# EasyEDA Pro project 3轴6.2--esp32S3.eprj, board PCB
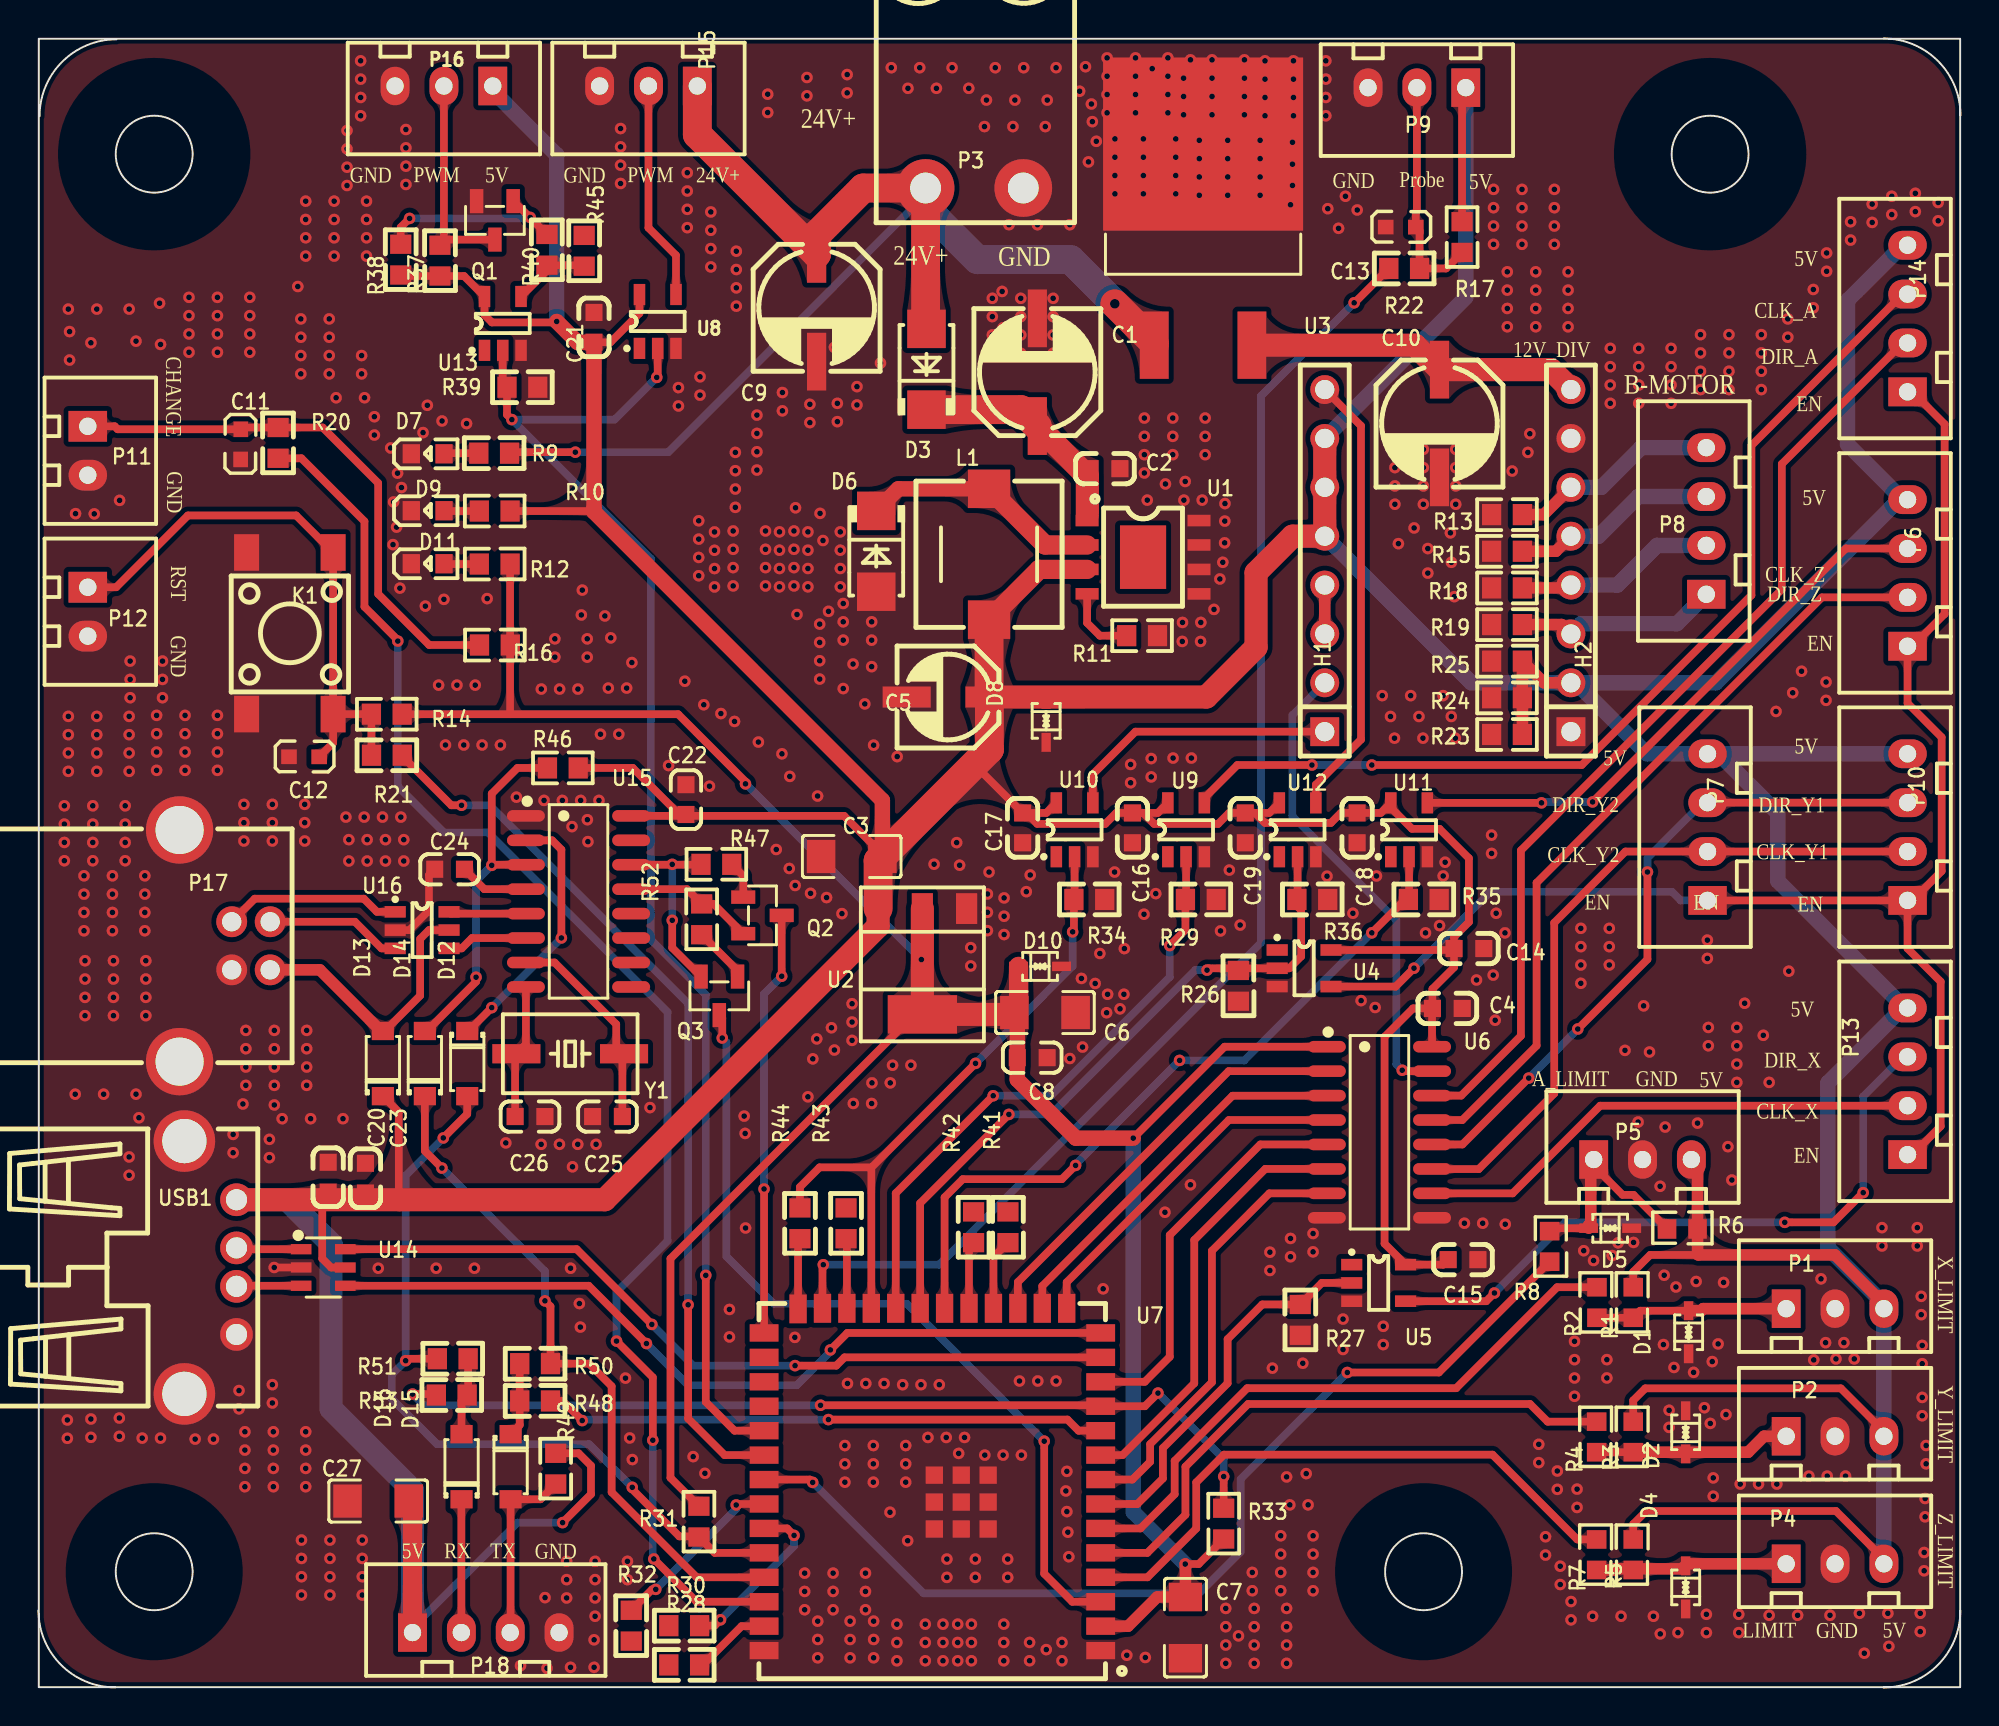
[diagram p1: board, top side]
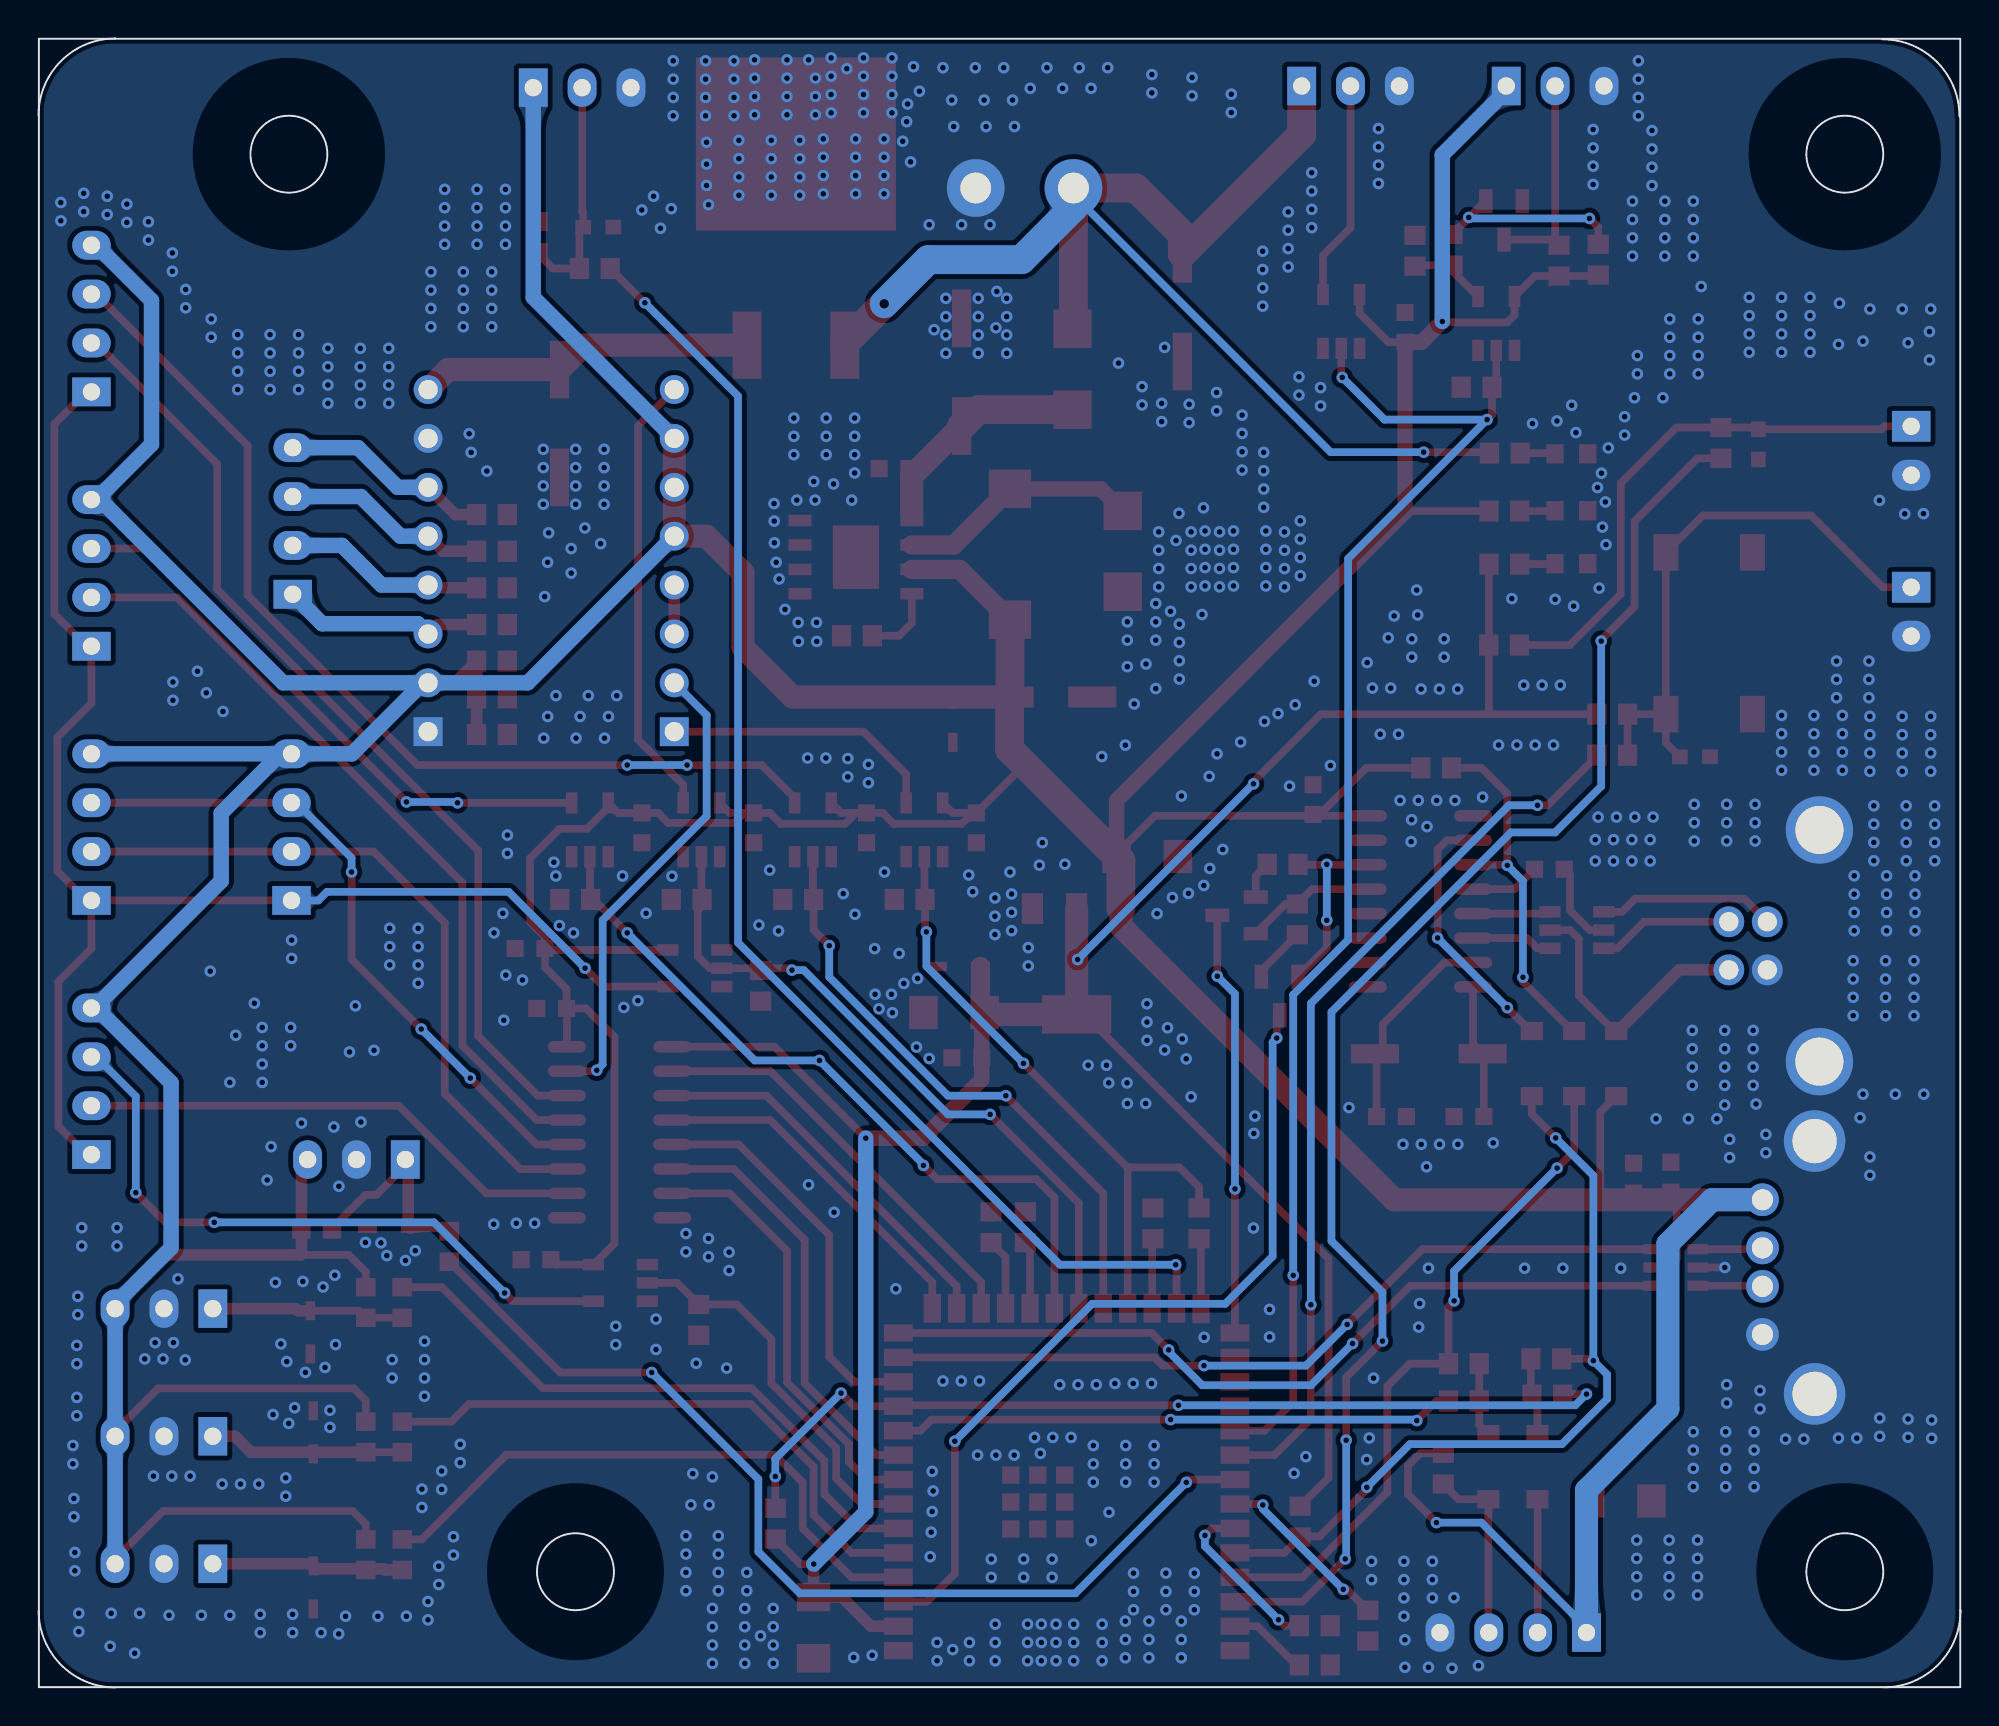
[diagram p2: board, bottom side, seen from below]

Outline 99.94 x 85.7 mm; copper layers: Top Layer, Bottom Layer. Coordinates in mm from the lower left corner of the outline.
Outline path: rectangle 0.02,85.69 99.92,0.02 ; circle c6.02,79.69 r2 ; circle c6.02,6.02 r2 ; circle c72.02,6.02 r2 ; circle c86.92,79.69 r2 ; 0.06,81.66 arc(1.23,84.49) 4.06,85.66 ; 4,0.01 arc(1.17,1.18) 0,4.01 ; 95.94,85.7 arc(98.77,84.53) 99.94,81.7 ; 99.93,4 arc(98.76,1.17) 95.93,0
Stack: Top Layer 0.035mm / Dielectric1 1.51mm FR4 er 4.5 / Bottom Layer 0.035mm

## Design rules (mm)
template: 用户自定义配置
spacing Default (default): track to track 0.152, other pairs 0 to 0.152
track width Default (default): min 0.254, default 0.254, max 25.4
differential pair differentialPair (default): width min 0.127, default 0.254, max 2.54; gap min 0.152, default 0.152
via Default (default): diameter min 0.25, default 0.61, max 100.025; hole min 0.2, default 0.305, max 59.995

## Placement (name value [footprint] x y rotation side)
C1  100uF/35V  [电解电容贴片6X6]  51.94 68.36 90 top
C2  104  [0603C]  55.45 63.34 180 top
C3  10uF  [C1206]  42.29 43.19 180 top
C4  104  [0603C]  73.25 35.29 180 top
C5  100uF/10V  [CAP-SMD_BD5.0-L5.3-W5.3-RD]  47.3 51.48 0 top
C6  4.7uF  [C1206]  52.33 35.08 180 top
C7  4.7uF  [C1206]  59.64 3.11 90 top
C8  104  [0603C]  51.67 32.73 180 top
C9  100uF/35V  [电解电容贴片6X6]  40.46 71.71 270 top
C10  100uF/35V(47uF/50V)  [电解电容贴片6X6]  72.85 65.69 270 top
C11  103  [11]  10.22 63.87 270 top
C12  103  [11]  13.07 48.67 180 top
C13  103  [11]  70.09 76.2 180 top
C14  104  [0603C]  74.38 38.4 180 top
C15  104  [0603C]  74.07 22.24 180 top
C16  104  [0603C]  56.88 44.68 90 top
C17  104  [0603C]  51.17 44.68 90 top
C18  104  [0603C]  68.56 44.68 90 top
C19  104  [0603C]  62.75 44.68 90 top
C20  104  [0603C]  17 26.47 90 top
C21  104  [0603C]  28.88 70.69 270 top
C22  104  [0603C]  33.67 46.15 90 top
C23  104  [0603C]  15.06 26.52 90 top
C24  104  [0603C]  21.38 42.53 180 top
C25  18pF  [0603C]  29.59 29.67 180 top
C26  18pF  [0603C]  25.56 29.67 0 top
C27  10uF  [C1206]  17.66 9.69 180 top
D1  PESD5V0L1BA  [SOD-323_L1.8-W1.3-LS2.5-BI]  85.8 18.46 90 top
D2  PESD5V0L1BA  [SOD-323_L1.8-W1.3-LS2.5-BI]  85.65 13.26 270 top
D3  SS56  [SMA]  46.17 68.51 90 top
D4  PESD5V0L1BA  [SOD-323_L1.8-W1.3-LS2.5-BI]  85.65 5.2 90 top
D5  PESD5V0L1BA  [SOD-323_L1.8-W1.3-LS2.5-BI]  81.72 23.87 180 top
D6  SS34  [SMA]  43.56 59.05 270 top
D7  绿光  [0603LED]  20.2 64.1 180 top
D8  PESD5V0L1BA-N  [SOD-323_L1.8-W1.3-LS2.5-BI]  52.39 50.24 90 top
D9  绿光  [0603LED]  20.2 61.14 180 top
D10  PESD3V3L1BA-N  [SOD-323_L1.8-W1.3-LS2.5-BI]  52.08 37.48 180 top
D11  绿光  [0603LED]  20.2 58.39 180 top
D12  1N4148  [SOD-123_L2.8-W1.8-LS3.7-RD]  22.29 32.43 270 top
D13  1N4148  [SOD-123_L2.8-W1.8-LS3.7-RD]  17.91 32.43 90 top
D14  1N4148  [SOD-123_L2.8-W1.8-LS3.7-RD]  20.09 32.43 90 top
D15  1N4148  [SOD-123_L2.8-W1.8-LS3.7-RD]  24.55 11.48 270 top
D16  1N4148  [SOD-123_L2.8-W1.8-LS3.7-RD]  22 11.48 90 top
H1  PZ254V-11-08P  [HDR-TH_8P-P2.54-V-M]  66.88 58.57 90 top
H2  PZ254V-11-08P  [HDR-TH_8P-P2.54-V-M]  79.68 58.57 90 top
K1  SW_6X6_H=12.0MM  [KEY-SMD_4P-L6.0-W6.0-P4.50-LS9.0]  13.07 54.79 90 top
L1  68uH  [IND-SMD_L7.0-W7.0_SMDRI74-330MT]  49.43 58.9 90 top
P1  3P  [HDR1X3_CON]  93.41 19.69 0 top
P2  3P  [HDR1X3_CON]  93.41 13.06 0 top
P3  WJ2EDGR-5.08-2P  [CONN-TH_WJ2EDGR-5.08-2P]  48.67 77.93 180 top
P4  3P  [HDR1X3_CON]  93.41 6.43 0 top
P5  3P  [HDR1X3_CON]  83.4 27.44 0 top
P6  4P  [HDR1X4_CON]  97.18 54.11 90 top
P7  4P  [HDR1X4_CON]  86.78 40.91 90 top
P8  4P  [HDR1X4_CON]  86.72 56.82 90 top
P9  3P  [HDR1X3_CON]  71.67 83.15 180 top
P10  4P  [HDR1X4_CON]  97.18 40.91 90 top
P11  2P  [HDR1X2_CON]  2.57 64.28 270 top
P12  2P  [HDR1X2_CON]  2.57 55.91 270 top
P13  4P  [HDR1X4_CON]  97.18 27.7 90 top
P14  4P  [HDR1X4_CON]  97.18 67.34 90 top
P15  3P  [HDR1X3_CON]  31.72 83.23 180 top
P16  3P  [HDR1X3_CON]  21.08 83.23 180 top
P17  USB-B10-BRW  [USB-B-TH_USB-B10-BRW]  9.69 38.55 270 top
P18  4P  [HDR1X4_CON]  19.45 2.86 0 top
Q1  SS8050  [SOT-23-3_L2.9-W1.3-P1.90-LS2.4-BR]  23.73 76.25 90 top
Q2  SS8050  [SOT-23-3_L2.9-W1.3-P1.90-LS2.4-BR]  37.64 40.13 180 top
Q3  SS8050  [SOT-23-3_L2.9-W1.3-P1.90-LS2.4-BR]  35.4 35.95 90 top
R1  20K  [10]  83.04 19.12 90 top
R2  100  [10]  81.15 19.12 90 top
R3  20K  [10]  83.04 12.13 90 top
R4  100  [10]  81.14 12.13 90 top
R5  20K  [10]  83.04 6.01 90 top
R6  20K  [10]  84.58 23.72 0 top
R7  100  [10]  81.14 6.01 90 top
R8  100  [10]  78.46 23.82 270 top
R9  47K  [0603R]  23.69 64.15 0 top
R10  10K  [0603R]  23.72 61.14 0 top
R11  10K  [0603R]  57.38 54.66 0 top
R12  10K  [0603R]  23.72 58.39 0 top
R13  10K  [0603R]  76.36 60.96 180 top
R14  10K  [0603R]  18.11 50.58 180 top
R15  10K  [0603R]  76.36 59.05 180 top
R16  10K  [0603R]  23.73 54.18 180 top
R17  10K  [0603R]  74.02 75.38 270 top
R18  10K  [0603R]  76.36 57.15 180 top
R19  10K  [0603R]  76.36 55.24 180 top
R20  100  [0603R]  12.46 64.68 90 top
R21  100  [0603R]  18.12 48.45 180 top
R22  100  [0603R]  71.01 73.75 0 top
R23  10K  [0603R]  76.36 49.53 180 top
R24  10K  [0603R]  76.36 51.44 180 top
R25  10K  [0603R]  76.36 53.34 180 top
R26  10K  [0603R]  62.39 36.47 270 top
R27  10K  [0603R]  65.61 19.11 270 top
R28  0Ω  [0603R]  33.58 1.17 0 top
R29  10K  [0603R]  60.44 40.95 0 top
R30  0Ω  [0603R]  33.58 3.21 0 top
R31  10K  [0603R]  34.34 8.62 270 top
R32  0Ω  [0603R]  30.82 3.21 90 top
R33  10K  [0603R]  61.63 8.52 270 top
R34  10K  [0603R]  54.64 40.95 0 top
R35  10K  [0603R]  72.03 40.95 0 top
R36  10K  [0603R]  66.23 40.95 0 top
R37  10K  [0603R]  20.88 74.16 270 top
R38  10K  [0603R]  18.84 74.21 270 top
R39  10K  [0603R]  25.16 67.58 0 top
R40  1K  [0603R]  26.44 74.72 90 top
R41  0Ω  [0603R]  50.41 23.92 270 top
R42  0Ω  [0603R]  48.62 23.92 270 top
R43  0Ω  [0603R]  41.99 24.12 270 top
R44  0Ω  [0603R]  39.59 24.12 270 top
R45  0Ω  [0603R]  28.37 74.67 270 top
R46  10K  [0603R]  27.27 47.79 0 top
R47  10K  [0603R]  35.25 42.78 0 top
R48  0Ω  [0603R]  25.82 14.89 0 top
R49  10K  [0603R]  26.89 11.37 90 top
R50  0Ω  [0603R]  25.82 16.83 180 top
R51  0Ω  [0603R]  21.54 17.09 0 top
R52  10K  [0603R]  34.48 39.92 270 top
R53  0Ω  [0603R]  21.49 15.2 0 top
U1  XL1509-5.0E1//SXL1509-5.0E1  [ESOP-8_L4.9-W3.9-P1.27-LS6.0-BL-EP]  57.43 58.74 270 top
U2  1117-3.3  [SOT-223]  45.96 37.78 180 top
U3  CJ7812  [TO-263-2_L10.1-W9.1-P5.08-LS15.2-TL]  60.55 74.99 90 top
U4  74LVC1G04  [SOT-23-5]  65.81 37.38 0 top
U5  74LVC1G17  [SOT-23-5]  69.68 21.03 0 top
U6  CA-IS3760  [SOIC-16_L9.9-W3.9-P1.27-LS6.0-BL]  69.72 28.86 270 top
U7  -  [ESP32-S3-WROOM-1U]  46.48 10.81 180 top
U8  74LVC1G17  [SOT-23-5]  32.2 70.99 90 top
U9  74LVC1G17  [SOT-23-5]  59.67 44.58 90 top
U10  74LVC1G17  [SOT-23-5]  53.87 44.58 90 top
U11  74LVC1G17  [SOT-23-5]  71.27 44.58 90 top
U12  74LVC1G17  [SOT-23-5]  65.47 44.58 90 top
U13  74LVC1G04  [SOT-23-5]  24.14 70.89 90 top
U14  MSUSBLC6-2SC6  [SOT-23-6_L2.9-W1.6-P0.95-LS2.8-BL]  14.81 21.83 270 top
U15  CH340G  [SOIC-16_L9.9-W3.9-P1.27-LS6.0-BL]  28.08 40.85 270 top
U16  USBLC2-2SC6  [SOT-23-6]  19.95 39.36 0 top
USB1  AF 90° WJDG  [USB-A-TH_AF-WJDG]  8.94 21.83 270 top
Y1  12M  [晶振贴片49SSMD]  27.65 32.94 0 top

## Footprints (pads in the part's own frame, mm; a bottom-side part is the same pattern mirrored in y, then rotated)
10
  rect 0.965x1.016 smd: 1(0.101,0.117) 2(1.688,0.117)
11
  rect 0.813x0.762 smd: 1(0.043,0.296) 2(-1.524,0.301)
0603C
  rect 0.889x0.889 smd: 1(-0.774,0) 2(0.774,0)
0603LED
  rect 0.9x1 smd: 1(-0.884,-0.017) 2(0.816,-0.017)
0603R
  rect 1x1.1 smd: 1(-0.8,0) 2(0.8,0)
C1206
  rect 1.485x1.728 smd: 1(-1.593,0) 2(1.593,0)
CAP-SMD_BD5.0-L5.3-W5.3-RD
  rect 2.5x1.1 smd: 1(2.15,0) 2(-2.15,0)
CONN-TH_WJ2EDGR-5.08-2P
  round 3 hole 1.6: 1(-2.54,0) 2(2.54,0)
ESOP-8_L4.9-W3.9-P1.27-LS6.0-BL-EP
  rect 0.6x1.2 smd: 1(-1.905,-2.909) 2(-0.635,-2.909) 3(0.635,-2.909) 4(1.905,-2.909) 5(1.905,2.909) 6(0.635,2.909) 7(-0.635,2.909) 8(-1.905,2.909)
  rect 3.3x2.4 smd: 9(0,0)
ESP32-S3-WROOM-1U
  rect 1.5x0.9 smd: 1(-8.75,8.895) 2(-8.75,7.625) 3(-8.75,6.355) 4(-8.75,5.085) 5(-8.75,3.815) 6(-8.75,2.545) 7(-8.75,1.275) 8(-8.75,0.005) 9(-8.75,-1.265) 10(-8.75,-2.535) 11(-8.75,-3.805) 12(-8.75,-5.075) 13(-8.75,-6.345) 14(-8.75,-7.615) 27(8.75,-7.615) 28(8.75,-6.345) 29(8.75,-5.075) 30(8.75,-3.805) 31(8.75,-2.535) 32(8.75,-1.265) 33(8.75,0.005) 34(8.75,1.275) 35(8.75,2.545) 36(8.75,3.815) 37(8.75,5.085) 38(8.75,6.355) 39(8.75,7.625) 40(8.75,8.895)
  rect 0.9x1.5 smd: 15(-6.985,-8.895) 16(-5.715,-8.895) 17(-4.445,-8.895) 18(-3.175,-8.895) 19(-1.905,-8.895) 20(-0.635,-8.895) 21(0.635,-8.895) 22(1.905,-8.895) 23(3.175,-8.895) 24(4.445,-8.895) 25(5.715,-8.895) 26(6.985,-8.865)
  rect 0.9x0.9 smd: 41(-2.9,2.575) 41(-2.9,1.175) 41(-2.9,-0.225) 41(-1.5,2.575) 41(-1.5,1.175) 41(-1.5,-0.225) 41(-0.1,2.575) 41(-0.1,1.175) 41(-0.1,-0.225)
HDR1X2_CON
  rect 1.6x2 hole 0.9: 1(-1.27,0)
  oval 1.6x2 hole 0.9: 2(1.27,0)
HDR1X3_CON
  rect 1.5x2 hole 0.9: 1(-2.54,0)
  oval 1.5x2 hole 0.9: 2(0,0) 3(2.54,0)
HDR1X4_CON
  rect 1.5x2 hole 0.9: 1(0,0)
  oval 1.5x2 hole 0.9: 2(2.54,0) 3(5.08,0) 4(7.62,0)
HDR-TH_8P-P2.54-V-M
  rect 1.5x1.5 hole 1: 1(-8.89,0)
  round 1.5 hole 1: 2(-6.35,0) 3(-3.81,0) 4(-1.27,0) 5(1.27,0) 6(3.81,0) 7(6.35,0) 8(8.89,0)
IND-SMD_L7.0-W7.0_SMDRI74-330MT
  rect 2x2.2 smd: 1(-3.4,0) 2(3.4,0)
KEY-SMD_4P-L6.0-W6.0-P4.50-LS9.0
  rect 1.9x1.3 smd: 1(-4.2,2.25) 2(4.2,2.25) 3(-4.2,-2.25) 4(4.2,-2.25)
SMA
  rect 2x2 smd: 1(2.1,0) 2(-2.1,0)
SOD-123_L2.8-W1.8-LS3.7-RD
  rect 0.95x1.15 smd: 1(-1.692,0) 2(1.692,0)
SOD-323_L1.8-W1.3-LS2.5-BI
  rect 0.986x0.49 smd: 1(-1.117,0) 2(1.117,0)
SOIC-16_L9.9-W3.9-P1.27-LS6.0-BL
  oval 0.602x1.971 smd: 1(-4.445,-2.736) 2(-3.175,-2.736) 3(-1.905,-2.736) 4(-0.635,-2.736) 5(0.635,-2.736) 6(1.905,-2.736) 7(3.175,-2.736) 8(4.445,-2.736) 9(4.445,2.736) 10(3.175,2.736) 11(1.905,2.736) 12(0.635,2.736) 13(-0.635,2.736) 14(-1.905,2.736) 15(-3.175,2.736) 16(-4.445,2.736)
SOT-23-3_L2.9-W1.3-P1.90-LS2.4-BR
  rect 1.25x0.7 smd: 1(1,-0.95) 2(1,0.95) 3(-1,0)
SOT-23-5
  rect 1.1x0.6 smd: 1(-1.4,0.95) 2(-1.4,0) 3(-1.4,-0.95) 4(1.4,-0.95) 5(1.4,0.95)
SOT-23-6
  rect 1.1x0.6 smd: 1(-1.4,0.95) 2(-1.4,0) 3(-1.4,-0.95) 4(1.4,-0.95) 5(1.4,0) 6(1.4,0.95)
SOT-23-6_L2.9-W1.6-P0.95-LS2.8-BL
  rect 0.532x1.072 smd: 1(-0.95,-1.149) 2(0,-1.149) 3(0.95,-1.149) 4(0.95,1.149) 5(0,1.149) 6(-0.95,1.149)
SOT-223
  rect 1.1x1.6 smd: 1(-2.3,-2.7) 2(0,-2.7) 3(2.3,-2.7)
  rect 3.6x2 smd: 4(0,2.8)
TO-263-2_L10.1-W9.1-P5.08-LS15.2-TL
  rect 3.5x1.5 smd: 1(-5.228,2.54) 3(-5.228,-2.54)
  rect 9x10.4 smd: 2(5.228,0)
USB-A-TH_AF-WJDG
  round 1.7 hole 1.1: 1(-3.521,1.355) 2(-1.018,1.355) 3(0.981,1.355) 4(3.48,1.355)
  round 3.2 hole 2.3: 5(-6.57,-1.355) 5(6.57,-1.355)
USB-B-TH_USB-B10-BRW
  round 1.6 hole 1: 1(1.25,2.355) 2(-1.25,2.355) 3(-1.25,0.355) 4(1.25,0.355)
  round 3.5 hole 2.5: 5(-6.02,-2.355) 6(6.02,-2.355)
晶振贴片49SSMD
  rect 2.5x1 smd: 1(-2.8,0) 2(2.8,0)
电解电容贴片6X6
  rect 3x1 smd: 1(-2.8,0) 2(2.8,0)

## Nets
As in the schematic.

Pads without a net: U1 9; U4 1; U5 1; U7 28 29 30; U8 1; U9 1; U10 1; U11 1; U12 1; U13 1; U15 9 10 11 12 15

## Via types
v1: diameter 0.6, hole 0.3, Top Layer to Bottom Layer, 1022 vias
v2: diameter 0.8, hole 0.5, Top Layer to Bottom Layer, 1 via

## Routing (per net, layer and track width the routed paths; a pad name or vN(x,y) marks a point on that pad's centre or on a via; arc(x,y) is an arc through that point)
3V3: length 139.9
  Top Layer w0.4: R12.2 24.52,50.59 24.53,50.58 ; R14.1 24.53,50.58 ; 24.53,50.58 33.26,50.58 36.76,47.08 v1(36.76,46.96) ; U6.1 61.67,33.3 v1(56.92,28.55) ; R31.1 32.86,10.9 32.86,22.29 45.56,34.98 U2.4 ; v1(59.63,6.42) 60.32,6.42 R33.2
  Top Layer w0.6: U7.2 56.65,3.19 58.17,4.7 C7.2 59.64,6.41 v1(59.63,6.42)
  Top Layer w0.8: C6.2 50.89,34.92 C8.2 50.89,31.59 53.93,28.55 v1(56.92,28.55)
  Top Layer w1: D10.2 50.96,35.3
  Top Layer w1.2: U2.2 U2.4 50.64,34.98 C6.2
  Bottom Layer w0.4: v1(36.76,46.96) 36.78,46.96 v1(45.91,37.83)
  Bottom Layer w0.8: v1(59.63,6.42) 56.92,9.12 v1(56.92,28.55)
5V_VCC: length 515.7
  Top Layer w0.4: U4.5 73.53,38.33 C14.2 ; 43.88,43.31 41.89,45.3 33.39,45.3 ; C15.2 73.04,21.98 U5.5 69.99,23.07 69.99,33.81 71.47,35.29 C4.2 ; C4.2 72.46,35.27 U6.16 ; C4.2 72.48,36.3 73.6,37.43 C14.2 ; R38.2 18.89,73.36 R37.2 22.13,73.36 U13.5 23.19,71.33 23.58,70.94 26.89,70.94 v1(26.95,70.99) ; P2.3 95.95,13.31 93.72,15.55 83.55,15.55 82.92,14.92 R3.2 ; U8.5 31.25,71.42 29.74,69.91 C21.2 ; 57.43,45.45 C16.2 56.04,45.45 55.47,44.88 51.94,44.88 51.36,45.45 52.4,45.45 U10.5 ; 57.43,45.45 58.2,45.45 U9.5 ; 57.43,45.45 58.01,44.88 61.33,44.88 61.9,45.45 C19.2 63.25,45.45 ; D13.1 18.73,29.91 18.73,25.37 18.76,25.35 ; 28.88,61.32 28.7,61.14 R10.2 ; P4.3 95.95,6.68 93.46,9.17 83.6,9.17 82.92,8.49 R5.2 ; C14.2 73.6,39.01 74.38,39.78 74.38,43.1 72.85,44.63 71.42,44.63 70.32,45.73 U11.5 69.79,45.45 C18.2 67.72,45.45 67.2,44.93 63.77,44.93 63.25,45.45 ; R1.2 82.92,21.6 83.8,22.48 86.3,22.48 ; U12.5 63.99,45.45 63.25,45.45 ; U14.5 15.22,21.83 14.76,22.29 14.76,25.31 14.8,25.35 ; R46.2 30.9,47.79 33.39,45.3 ; 33.39,45.3 U15.16 ; R17.1 74.02,82.95 P9.1 ; R49.2 28.08,12.17 28.73,11.53 28.73,10.05 v1(27.25,8.57) ; C17.2 48.83,47.79 48.77,47.79
  Top Layer w0.6: P1.3 95.95,19.94 93.41,22.48 86.3,22.48 86.26,22.52 R6.2 86.26,27.12 P5.3 ; H2.2 78.28,52.22 R25.1 R24.1 R23.1
  Top Layer w0.8: v1(26.95,70.99) 28.03,69.91 C21.2 28.88,61.1 43.88,46.11 43.88,43.31
  Top Layer w1: C27.1 19.45,9.5 P18.1 ; U1.3 52.04,58.11 L1.1
  Top Layer w1.2: USB1.1 29.45,25.35 43.66,39.56 U2.3 ; C5.1 60.72,51.48 63.31,54.06 63.31,57.94 65.21,59.84 H1.5 H1.6 H1.7
  Top Layer w1.5: L1.1 49.43,51.5 C5.1 49.45,48.75 C3.1 43.66,42.97 U2.3
  Bottom Layer w0.4: 19.45,3.11 24.91,8.57 v1(27.25,8.57)
  Bottom Layer w0.8: P14.4 96.93,74.96 94.06,72.08 94.06,64.61 96.93,61.73 ; H1.7 74.21,72.25 P9.1 ; P4.3 P2.3 P1.3 95.95,19.94 93.04,22.85 93.04,31.43 96.93,35.32 97.04,35.32 ; v1(26.95,70.99) 26.95,79.66 23.62,82.98 P16.1 ; H1.5 74.5,52.22 H2.2 ; 97.04,35.32 90.43,41.92 90.43,45.44 87.35,48.53 97.18,48.53 ; 97.04,35.32 P13.4 ; 96.93,61.73 96.74,61.73 87.22,52.22 79.95,52.22 83.64,48.53 86.78,48.53 ; 96.93,61.73 P6.4
  Bottom Layer w1.2: P18.1 19.45,10.25 15.22,14.49 15.22,23.05 12.92,25.35 USB1.1
12V_DIV: length 17.5
  Top Layer w1.2: U3.3 71.58,69.76 C10.1 78.65,68.49 H2.8
24V: length 69.4
  Top Layer w0.4: v1(27.91,64.2) 24.55,64.2 R9.2
  Top Layer w1.5: U3.1 58.02,69.86 v2(55.96,71.91) ; D3.1 46.13,70.66 P3.2 42.88,77.93 40.46,75.51 C9.1 34.26,80.71 P15.1
  Bottom Layer w0.4: 46.13,77.58 32.75,64.2 v1(27.91,64.2)
  Bottom Layer w1.5: v2(55.96,71.91) 53.67,74.21 48.83,74.21 46.13,76.91 P3.2
GND: length 5.8
  Top Layer w0.4: U16.2 19.28,39.36 20.3,40.38 20.3,42.23 C24.2 ; U14.2 v1(12.26,21.83)
  vias: v1(1.35,45.82) v1(1.35,44.87) v1(1.35,43.92) v1(1.35,42.97) v1(1.5,13.9) v1(1.5,12.95) v1(1.55,71.64) v1(1.55,50.47) v1(1.55,49.52) v1(1.55,48.57) v1(1.55,47.61) v1(1.62,70.47) v1(1.62,68.99) v1(1.91,30.84) v1(1.93,61.01) v1(2.37,42.19) v1(2.37,41.23) v1(2.37,40.28) v1(2.37,39.33) v1(2.42,37.77) v1(2.42,36.82) v1(2.42,35.87) v1(2.42,34.92) v1(2.73,69.89) v1(2.73,13.95) v1(2.73,13) v1(2.9,61) v1(2.83,45.82) v1(2.83,44.87) v1(2.83,43.92) v1(2.83,42.97) v1(3.03,71.64) v1(3.03,50.47) v1(3.03,49.52) v1(3.03,48.57) v1(3.03,47.61) v1(3.39,30.84) v1(3.85,42.19) v1(3.85,41.23) v1(3.85,40.28) v1(3.85,39.33) v1(3.9,37.77) v1(3.9,36.82) v1(3.9,35.87) v1(3.9,34.92) v1(4.2,14.01) v1(4.2,13.05) v1(4.22,61.7) v1(4.51,45.82) v1(4.51,44.87) v1(4.51,43.92) v1(4.51,42.97) v1(4.71,27.57) v1(4.71,26.62) v1(4.72,71.64) v1(4.77,53.34) v1(4.77,52.39) v1(4.77,51.44) v1(4.72,50.47) v1(4.72,49.52) v1(4.72,48.57) v1(4.72,47.61) v1(5.07,69.97) v1(5.07,30.84) v1(5.22,29.61) v1(5.39,12.96) v1(5.53,42.19) v1(5.53,41.23) v1(5.53,40.28) v1(5.53,39.33) v1(5.58,37.77) v1(5.58,36.82) v1(5.58,35.87) v1(5.58,34.92) v1(6.14,50.52) v1(6.14,49.57) v1(6.14,48.62) v1(6.14,47.67) v1(6.3,71.94) v1(6.35,69.8) v1(6.34,12.96) v1(6.45,53.34) v1(6.45,52.39) v1(6.45,51.44) v1(7.62,50.52) v1(7.62,49.57) v1(7.62,48.62) v1(7.62,47.67) v1(7.83,72.25) v1(7.83,71.3) v1(7.83,70.34) v1(7.83,69.39) v1(8.15,12.91) v1(9.1,12.91) v1(9.31,72.25) v1(9.31,71.3) v1(9.31,70.34) v1(9.31,69.39) v1(9.31,50.52) v1(9.31,49.57) v1(9.31,48.62) v1(9.31,47.67) v1(10.12,28.75) v1(10.12,27.79) v1(10.43,15.43) v1(10.43,14.48) v1(10.68,45.9) v1(10.68,44.95) v1(10.68,43.99) v1(10.63,30.33) v1(10.78,34.15) v1(10.78,33.2) v1(10.78,32.25) v1(10.78,31.3) v1(10.73,13.29) v1(10.73,12.34) v1(10.73,11.39) v1(10.73,10.44) v1(10.99,72.25) v1(10.99,71.3) v1(10.99,70.34) v1(10.99,69.39) v1(12.01,28.49) v1(12.01,27.54) v1(12.16,45.9) v1(12.16,44.95) v1(12.16,43.99) v1(12.16,15.74) v1(12.16,14.79) v1(12.21,13.29) v1(12.21,12.34) v1(12.21,11.39) v1(12.21,10.44) v1(12.26,34.15) v1(12.26,33.2) v1(12.26,32.25) v1(12.26,31.3) v1(12.26,30.28) v1(12.67,29.56) v1(13.48,72.81) v1(13.64,71.13) v1(13.64,70.17) v1(13.64,69.22) v1(13.64,68.27) v1(13.67,7.66) v1(13.67,6.71) v1(13.67,5.76) v1(13.67,4.81) v1(13.89,77.25) v1(13.89,76.29) v1(13.89,75.34) v1(13.89,74.39) v1(13.84,45.9) v1(13.84,44.95) v1(13.84,43.99) v1(13.89,13.29) v1(13.89,12.34) v1(13.89,11.39) v1(13.89,10.44) v1(13.95,34.15) v1(13.95,33.2) v1(13.95,32.25) v1(13.95,31.3) v1(14.15,29.56) v1(15.12,71.13) v1(15.12,70.17) v1(15.12,69.22) v1(15.12,68.27) v1(15.15,7.66) v1(15.15,6.71) v1(15.15,5.76) v1(15.15,4.81) v1(15.37,77.25) v1(15.37,76.29) v1(15.37,75.34) v1(15.37,74.39) v1(15.48,67.03) v1(15.83,29.56) v1(15.98,45.24) v1(16.04,80.92) v1(16.04,79.96) v1(16.04,79.01) v1(16.04,78.06) v1(16.14,44.06) v1(16.14,42.95) v1(16.75,84.54) v1(16.75,83.59) v1(16.75,82.64) v1(16.75,81.68) v1(16.8,69.22) v1(16.8,68.27) v1(16.84,7.66) v1(16.84,6.71) v1(16.84,5.76) v1(16.84,4.81) v1(16.95,67.03) v1(16.94,45.24) v1(17.06,77.25) v1(17.06,76.29) v1(17.06,75.34) v1(17.06,74.39) v1(17.09,44.06) v1(17.09,42.95) v1(17.47,66.04) v1(17.47,65.09) v1(17.67,21.79) v1(17.89,45.24) v1(18.04,44.06) v1(18.04,42.95) v1(18.31,64.42) v1(18.47,61.61) v1(18.43,59.4) v1(18.67,63.11) v1(18.62,60.31) v1(18.79,57.14) v1(18.88,62.36) v1(18.84,45.24) v1(18.99,44.06) v1(18.99,42.95) v1(19.11,80.97) v1(19.11,80.02) v1(19.11,79.07) v1(19.11,78.11) v1(20,65.22) v1(20.12,56.2) v1(20.22,66.64) v1(20.68,21.79) v1(20.81,52.09) v1(20.98,65.82) v1(21.08,56.55) v1(21.16,48.98) v1(21.76,52.09) v1(22.12,48.98) v1(22.26,65.69) v1(22.71,52.09) v1(22.67,21.79) v1(23.07,48.98) v1(23.33,56.59) v1(24.02,48.98) v1(24.3,28.3) v1(24.85,46.27) v1(25.06,1.14) v1(26.14,51.89) v1(26.14,28.23) v1(26.29,46.1) v1(26.34,4.67) v1(26.44,1) v1(26.85,54.5) v1(26.85,53.55) v1(27.1,51.89) v1(27.09,28.23) v1(27.24,46.1) v1(27.46,6.56) v1(27.46,5.61) v1(27.46,4.66) v1(27.67,21.79) v1(27.67,1.05) v1(27.74,44.74) v1(27.77,27.06) v1(28.05,51.89) v1(28.04,28.23) v1(28.19,46.1) v1(28.12,19.96) v1(28.18,18.73) v1(28.28,57.03) v1(28.23,55.74) v1(28.53,54.5) v1(28.53,53.55) v1(28.54,45.1) v1(28.57,43.96) v1(28.89,2.48) v1(28.89,1.05) v1(28.99,28.23) v1(28.94,6.56) v1(28.94,5.61) v1(28.94,4.66) v1(28.94,3.7) v1(29.14,46.1) v1(29.22,49.54) v1(29.45,55.69) v1(29.63,51.94) v1(29.76,54.55) v1(30.17,49.54) v1(30.27,81.02) v1(30.27,80.07) v1(30.27,79.12) v1(30.27,78.16) v1(30.58,51.94) v1(30.52,16.08) v1(30.62,6.56) v1(30.62,5.61) v1(30.74,12.97) v1(30.85,53.27) v1(30.88,11.85) v1(31.8,30.14) v1(32.76,47.91) v1(33.28,67.56) v1(33.28,66.6) v1(33.61,52.3) v1(33.73,78.73) v1(33.73,77.77) v1(33.73,76.82) v1(33.73,75.87) v1(34.04,12) v1(34.4,68.12) v1(34.4,67.17) v1(34.33,60.63) v1(34.33,59.68) v1(34.33,58.73) v1(34.33,57.78) v1(34.59,51.07) v1(34.65,11.13) v1(34.89,46.84) v1(34.96,76.69) v1(34.96,75.73) v1(34.96,74.78) v1(34.96,73.83) v1(35.15,60.06) v1(35.15,59.1) v1(35.15,58.15) v1(35.15,57.2) v1(35.48,50.62) v1(35.93,19.65) v1(35.93,18.22) v1(36.12,60.11) v1(36.12,59.15) v1(36.12,58.2) v1(36.12,57.25) v1(36.19,50.21) v1(36.28,74.65) v1(36.28,73.69) v1(36.28,72.74) v1(36.28,71.79) v1(36.23,64.19) v1(36.23,63.24) v1(36.23,62.29) v1(36.23,61.33) v1(36.69,29.7) v1(36.74,28.8) v1(36.77,23.88) v1(37.36,66.13) v1(37.36,65.18) v1(37.36,64.22) v1(37.36,63.27) v1(37.43,49.14) v1(37.8,60.11) v1(37.8,59.15) v1(37.8,58.2) v1(37.8,57.25) v1(37.92,82.81) v1(37.92,81.85) v1(38.36,43.55) v1(38.53,60.06) v1(38.53,59.11) v1(38.53,58.16) v1(38.53,57.2) v1(38.68,67.3) v1(38.68,66.35) v1(38.66,48.52) v1(39.07,47.35) v1(39.04,42.57) v1(39.28,60.11) v1(39.28,59.15) v1(39.28,58.2) v1(39.28,57.25) v1(39.36,61.31) v1(39.34,41.68) v1(39.33,18.2) v1(39.44,55.77) v1(39.84,5.94) v1(39.84,4.99) v1(39.84,4.04) v1(39.96,83.67) v1(39.96,82.72) v1(40.01,60.06) v1(40.01,59.11) v1(40.01,58.16) v1(40.01,57.2) v1(40.01,30.7) v1(40.11,66.69) v1(40.11,65.74) v1(40.14,41.27) v1(40.26,32.67) v1(40.51,46.33) v1(40.47,33.71) v1(40.52,3.45) v1(40.52,2.5) v1(40.52,1.54) v1(40.64,61.02) v1(40.62,55.27) v1(40.62,54.31) v1(40.62,53.36) v1(40.62,52.41) v1(40.79,59.61) v1(40.98,41.05) v1(41.08,55.93) v1(41.23,34.29) v1(41.38,69.65) v1(41.38,33.13) v1(41.32,5.94) v1(41.32,4.99) v1(41.32,4.04) v1(41.54,66.74) v1(41.54,65.79) v1(41.69,60.06) v1(41.69,59.11) v1(41.69,58.16) v1(41.69,57.2) v1(41.78,40.22) v1(41.84,56.34) v1(41.84,55.38) v1(41.84,54.43) v1(41.84,51.92) v1(41.93,12.57) v1(41.93,11.62) v1(41.93,10.67) v1(42.05,83.83) v1(42.05,82.87) v1(42.07,15.8) v1(42.2,3.45) v1(42.2,2.5) v1(42.2,1.54) v1(42.3,35.54) v1(42.3,34.58) v1(42.3,33.63) v1(42.35,53.19) v1(42.37,30.35) v1(42.56,67.61) v1(42.56,66.66) v1(42.97,51.12) v1(43,5.94) v1(43,4.99) v1(43,4.04) v1(43.02,15.8) v1(43.32,55.38) v1(43.32,54.43) v1(43.32,53.06) v1(43.34,31.42) v1(43.32,30.35) v1(43.41,12.57) v1(43.41,11.62) v1(43.41,10.67) v1(43.42,48.97) v1(43.42,3.45) v1(43.42,2.5) v1(43.42,1.54) v1(43.78,68.83) v1(43.97,15.8) v1(44.29,31.42) v1(44.28,9.11) v1(44.34,84.18) v1(44.41,32.34) v1(44.65,48.38) v1(44.63,3.29) v1(44.63,2.34) v1(44.63,1.39) v1(44.93,15.74) v1(45.09,12.57) v1(45.09,11.62) v1(45.09,10.67) v1(45.21,83.11) v1(45.19,7.63) v1(45.36,32.34) v1(45.82,84.18) v1(45.89,15.74) v1(46.11,3.29) v1(46.11,2.34) v1(46.11,1.39) v1(46.25,13) v1(46.57,42.79) v1(46.69,83.11) v1(46.84,15.74) v1(47.03,3.29) v1(47.03,2.34) v1(47.03,1.39) v1(47.2,13) v1(47.23,6.68) v1(47.23,5.72) v1(47.5,84.18) v1(47.74,43.91) v1(47.79,3.29) v1(47.79,2.34) v1(47.79,1.39) v1(47.89,42.74) v1(47.85,12.17) v1(48.15,13) v1(48.37,83.11) v1(48.47,38.45) v1(48.47,37.5) v1(48.51,3.29) v1(48.51,2.34) v1(48.51,1.39) v1(48.71,6.68) v1(48.71,5.72) v1(49.19,81.12) v1(49.2,12.08) v1(49.29,82.5) v1(49.34,41.24) v1(49.34,40.29) v1(49.34,39.34) v1(49.42,42.38) v1(49.6,72.2) v1(49.6,71.25) v1(49.6,70.29) v1(49.6,69.34) v1(49.75,84.18) v1(50.11,72.55) v1(50.16,70.67) v1(50.21,41.04) v1(50.21,40.08) v1(50.21,39.13) v1(50.16,12.08) v1(50.19,3.29) v1(50.19,2.34) v1(50.19,1.39) v1(50.4,6.68) v1(50.4,5.72) v1(50.46,76.02) v1(50.67,81.12) v1(50.77,82.5) v1(51.01,15.93) v1(51.07,72.2) v1(51.07,71.25) v1(51.07,70.29) v1(51.07,69.34) v1(51.11,12.08) v1(51.23,84.18) v1(51.36,41.36) v1(51.57,42.23) v1(51.53,2.34) v1(51.53,1.39) v1(51.94,76.02) v1(51.96,15.93) v1(52.35,81.12) v1(52.4,1.97) v1(52.45,82.5) v1(52.76,72.2) v1(52.76,71.25) v1(52.76,70.29) v1(52.76,69.34) v1(52.91,84.18) v1(52.91,15.93) v1(53.22,2.34) v1(53.22,1.39) v1(53.37,70.57) v1(53.47,11.23) v1(53.42,10.21) v1(53.47,9.14) v1(53.52,8.07) v1(53.57,6.8) v1(53.62,76.02) v1(53.62,32.69) v1(54.13,82.96) v1(54.23,36.85) v1(54.29,33.28) v1(54.44,84.23) v1(54.59,79.29) v1(54.75,82.3) v1(54.8,81.38) v1(55,80.36) v1(54.94,36.59) v1(55.19,38.15) v1(55.36,20.72) v1(55.56,84.69) v1(55.56,83.74) v1(55.56,82.79) v1(55.56,81.84) v1(55.59,36.03) v1(55.54,35.07) v1(55.97,80.48) v1(55.97,79.53) v1(55.97,78.58) v1(55.97,77.63) v1(55.95,42.38) v1(56.24,35.27) v1(56.46,38.4) v1(56.44,36.03) v1(56.59,1.68) v1(56.79,47.97) v1(56.79,47.02) v1(57.04,84.69) v1(57.04,83.74) v1(57.04,82.79) v1(57.04,81.84) v1(57.45,80.48) v1(57.45,79.53) v1(57.45,78.58) v1(57.45,77.63) v1(57.5,65.97) v1(57.5,65.02) v1(57.5,64.07) v1(57.5,63.12) v1(57.48,40.19) v1(57.55,1.56) v1(57.65,61.71) v1(57.91,84.13) v1(57.86,48.28) v1(57.86,47.33) v1(58.09,41.26) v1(58.6,62.55) v1(58.57,24.7) v1(58.72,84.69) v1(58.72,83.74) v1(58.72,82.79) v1(58.72,81.84) v1(58.98,65.97) v1(58.98,65.02) v1(58.98,64.07) v1(58.99,48.3) v1(59.13,80.48) v1(59.13,79.53) v1(59.13,78.58) v1(59.13,77.63) v1(59.48,55.35) v1(59.47,54.36) v1(59.54,83.64) v1(59.54,82.69) v1(59.54,81.73) v1(59.56,61.71) v1(59.62,62.68) v1(59.9,84.59) v1(59.9,26.13) v1(59.95,48.3) v1(60.36,80.41) v1(60.36,79.46) v1(60.36,78.5) v1(60.36,77.55) v1(60.51,61.71) v1(60.44,55.35) v1(60.42,54.36) v1(60.66,65.97) v1(60.66,65.02) v1(60.66,64.07) v1(61.02,84.59) v1(61.02,83.64) v1(61.02,82.69) v1(61.02,81.73) v1(61.12,56.03) v1(61.43,57.61) v1(61.46,39.32) v1(61.58,58.48) v1(61.69,61.53) v1(61.68,60.62) v1(61.67,59.49) v1(61.73,4.11) v1(61.73,3.16) v1(61.73,2.21) v1(61.73,1.26) v1(61.84,80.41) v1(61.84,79.46) v1(61.84,78.5) v1(61.84,77.55) v1(61.92,42.48) v1(62.4,2.68) v1(62.48,39.63) v1(62.7,84.59) v1(62.7,83.64) v1(62.7,82.69) v1(62.7,81.73) v1(63.11,5.98) v1(63.11,5.03) v1(63.21,4.11) v1(63.21,3.16) v1(63.21,2.21) v1(63.21,1.26) v1(63.52,80.41) v1(63.52,79.46) v1(63.52,78.5) v1(63.52,77.55) v1(63.77,84.54) v1(63.77,83.59) v1(63.77,82.64) v1(63.77,81.68) v1(64.03,22.62) v1(64.03,21.67) v1(64.16,16.6) v1(64.59,7.89) v1(64.59,6.93) v1(64.59,5.98) v1(64.59,5.03) v1(64.9,10.95) v1(64.9,4.11) v1(64.9,3.16) v1(64.9,2.21) v1(64.9,1.26) v1(65.1,77.06) v1(65.1,23.34) v1(65.1,22.39) v1(65.06,9.49) v1(65.2,80.31) v1(65.2,79.17) v1(65.2,78.06) v1(65.25,84.54) v1(65.25,83.59) v1(65.25,82.64) v1(65.25,81.68) v1(65.74,16.85) v1(65.92,11.12) v1(66.02,9.49) v1(66.27,23.59) v1(66.27,22.64) v1(66.27,7.89) v1(66.27,6.93) v1(66.27,5.98) v1(66.27,5.03) v1(66.94,84.54) v1(66.94,83.59) v1(66.94,82.64) v1(66.94,81.68) v1(67,42.17) v1(67.04,76.86) v1(67.6,75.84) v1(67.83,19.15) v1(67.83,17.57) v1(67.96,77.5) v1(68.35,40.24) v1(68.57,76.79) v1(68.77,35.7) v1(69.5,35.34) v1(69.57,42.18) v1(69.87,51.55) v1(69.92,18.77) v1(69.92,17.82) v1(70.3,50.46) v1(70.51,49.34) v1(70.53,64.35) v1(70.53,63.4) v1(70.53,62.45) v1(70.53,61.49) v1(70.71,59.45) v1(71.35,51.55) v1(71.53,60.26) v1(71.78,50.46) v1(72.01,64.35) v1(72.01,63.4) v1(72.01,62.45) v1(72.01,61.49) v1(71.99,49.34) v1(72.12,39.22) v1(72.24,59.19) v1(72.24,57.92) v1(72.85,39.6) v1(73.03,51.55) v1(73.04,42.18) v1(73.14,42.89) v1(73.41,60.01) v1(73.46,58.48) v1(73.46,50.46) v1(73.69,64.35) v1(73.69,63.4) v1(73.69,62.45) v1(73.69,61.49) v1(73.62,56.69) v1(73.67,49.34) v1(74.14,24.13) v1(74.77,36.77) v1(75.09,24.13) v1(75.55,44.3) v1(75.55,43.35) v1(75.66,77.86) v1(75.66,76.91) v1(75.66,75.95) v1(75.66,75) v1(75.64,37.03) v1(75.79,40.24) v1(75.74,34.68) v1(76.25,39.22) v1(76.27,24.08) v1(76.37,73.57) v1(76.37,72.62) v1(76.37,71.67) v1(76.37,70.72) v1(76.63,63.22) v1(77.14,77.86) v1(77.14,76.91) v1(77.14,75.95) v1(77.14,75) v1(77.44,64.19) v1(77.54,65.16) v1(77.85,73.57) v1(77.85,72.62) v1(77.85,71.67) v1(77.85,70.72) v1(78.01,12.64) v1(78.01,11.69) v1(78.36,7.83) v1(78.36,6.88) v1(78.82,77.86) v1(78.82,76.91) v1(78.82,75.95) v1(78.82,75) v1(78.97,11.25) v1(78.97,10.3) v1(79.13,6.3) v1(79.13,5.35) v1(79.53,73.57) v1(79.53,72.62) v1(79.53,71.67) v1(79.53,70.72) v1(79.69,4.47) v1(79.69,3.52) v1(79.87,17.99) v1(79.87,17.04) v1(79.87,16.09) v1(79.87,15.14) v1(80,10.31) v1(80,9.36) v1(80.2,39.45) v1(80.2,38.5) v1(80.2,37.55) v1(80.2,36.6) v1(80.35,22.7) v1(80.81,3.7) v1(80.86,22.19) v1(81.55,17.04) v1(81.55,16.09) v1(81.67,39.45) v1(81.67,38.5) v1(81.67,37.55) v1(81.73,69.6) v1(81.73,68.64) v1(81.73,67.69) v1(81.73,66.74) v1(81.83,22.45) v1(82.13,23.11) v1(82.29,3.7) v1(82.49,33.11) v1(82.94,23.13) v1(83.2,69.6) v1(83.2,68.64) v1(83.2,67.69) v1(83.2,66.74) v1(83.17,29.39) v1(83.46,35.43) v1(83.77,33.03) v1(83.97,3.7) v1(84.32,26.05) v1(84.33,2.79) v1(84.49,17.82) v1(84.58,29.13) v1(84.53,21.43) v1(84.78,14.41) v1(84.78,13.52) v1(84.89,69.6) v1(84.89,68.64) v1(84.89,67.69) v1(84.89,66.74) v1(85.04,16.63) v1(85.14,20.81) v1(85.24,2.85) v1(86.06,16.38) v1(86.19,21.1) v1(86.26,29.33) v1(86.42,70.31) v1(86.42,69.36) v1(86.42,68.41) v1(86.42,67.45) v1(86.62,14.54) v1(86.77,38.84) v1(86.77,37.89) v1(86.72,3.81) v1(86.72,2.85) v1(86.83,34.3) v1(86.83,33.35) v1(86.93,13.73) v1(87.03,16.94) v1(87.08,10.89) v1(87.08,9.94) v1(87.33,17.86) v1(87.62,21.05) v1(87.74,14.19) v1(87.9,70.31) v1(87.9,69.36) v1(87.9,68.41) v1(87.9,67.45) v1(87.84,28.11) v1(88.05,26.37) v1(88.3,34.3) v1(88.3,33.35) v1(88.3,32.4) v1(88.3,31.45) v1(88.41,3.81) v1(88.41,2.85) v1(88.48,10.57) v1(88.71,35.56) v1(89.43,10.57) v1(89.58,70.31) v1(89.58,69.36) v1(89.58,68.41) v1(89.58,67.45) v1(89.68,33.9) v1(89.99,31.45) v1(89.99,3.75) v1(90.35,50.73) v1(90.39,10.57) v1(90.96,71.13) v1(90.96,70.17) v1(91.01,37.23) v1(91.21,51.69) v1(91.47,3.75) v1(91.67,52.82) v1(92.05,10.99) v1(92.28,72.66) v1(92.28,71.7) v1(92.3,17.03) v1(92.68,21.24) v1(92.98,74.55) v1(92.98,73.6) v1(92.95,52.26) v1(92.95,51.3) v1(92.92,17.92) v1(93.01,10.99) v1(93.15,3.75) v1(93.46,17.08) v1(93.87,17.92) v1(93.96,10.99) v1(94.22,76.18) v1(94.22,75.22) v1(94.41,17.08) v1(94.68,3.86) v1(94.93,1.78) v1(95.34,77.09) v1(95.34,76.14) v1(95.85,23.9) v1(95.85,22.95) v1(96.16,3.86) v1(96.21,2.14) v1(96.36,77.5) v1(96.36,76.55) v1(97.59,77.65) v1(97.59,76.7) v1(97.69,23.9) v1(97.69,22.95) v1(97.89,20.33) v1(97.89,19.38) v1(97.84,3.86) v1(97.84,2.9) v1(97.94,17.78) v1(97.94,16.83) v1(97.94,15.08) v1(97.94,14.12) v1(98.1,9.82) v1(98.1,8.87) v1(98.05,7.02) v1(98.05,6.07) v1(98.15,12.58) v1(98.15,11.63) v1(98.78,77.18) v1(98.78,76.23)
VIN_24V: length 11.8
  Top Layer w1.2: 54.54,61 54.54,62.96 C1.1
  Top Layer w1.5: C1.1 51.08,66.41 D3.2
A_DIR_O: length 52.2
  Top Layer w0.4: P14.3 96.93,72.42 89.06,64.55 89.06,56.76 80.24,47.94 v1(69.33,47.94) ; U9.4 60.62,46.23 62.34,47.94 v1(66.22,47.94)
  Bottom Layer w0.4: v1(66.22,47.94) v1(69.33,47.94)
A_LIMT: length 52.6
  Top Layer w0.4: v1(40.26,10.66) 40.11,10.81 U7.33 ; v1(68.05,16.37) 72.81,16.37 R8.2
  Bottom Layer w0.4: v1(68.05,16.37) 62.51,10.83 62.51,7.06 60.35,4.9 46.02,4.9 v1(40.26,10.66)
A_LIMT_I: length 10.8
  Top Layer w0.4: D5.2 78.72,23.87 R8.1 ; R6.1 84.68,23.86 82.93,25.6 82.37,25.6 81.15,26.82 80.86,26.82 P5.1
  Top Layer w0.6: 80.86,26.82 80.71,26.66 80.71,24.13 80.6,24.02 D5.2
A_STEP_O: length 50.4
  Top Layer w0.4: P14.2 96.93,69.88 90.65,63.59 90.65,57.07 77.08,43.5 77.08,33.87 73.98,30.76 U6.14
B_1A: length 10.5
  Top Layer w0.6: H2.4 79.53,57.15 R18.1
  Bottom Layer w0.8: H2.4 82.1,57.3 84.16,59.36 P8.2
B_1B: length 10.6
  Top Layer w0.6: H2.3 79.2,55.24 R19.1
  Bottom Layer w0.8: P8.1 85.19,55.29 80.21,55.29 H2.3
B_2A: length 10.7
  Top Layer w0.6: H2.5 78.9,59.05 R15.1
  Bottom Layer w0.8: P8.3 83.18,61.9 81.12,59.84 H2.5
B_2B: length 11
  Top Layer w0.6: H2.6 78.26,60.96 R13.1
  Bottom Layer w0.8: H2.6 81.26,62.38 83.32,64.44 P8.4
B_DIR_O: length 14.5
  Top Layer w0.4: H1.1 57.04,49.68 54.82,47.46 U10.4
B_STEP_O: length 24.8
  Top Layer w0.4: U6.15 70.96,32.03 v1(70.91,32.08)
  Bottom Layer w0.4: v1(70.91,32.08) 70.6,32.39 70.6,39.88 65.2,45.29 65.2,50.53 H1.2
CHANGE: length 76.2
  Top Layer w0.4: v1(31.94,12.85) 31.94,16.12 v1(30.06,18) ; R20.1 13.67,63.88 16.95,60.61 16.95,56.17 18.68,54.43 v1(18.68,54.38) ; U7.38 34.22,4.46 v1(31.99,6.68)
  Bottom Layer w0.4: v1(31.94,12.85) 31.94,6.73 v1(31.99,6.68) ; v1(18.68,54.38) 18.68,46.84 21.08,44.44 23.38,44.44 32.71,35.11 32.71,23.21 30.06,20.55 v1(30.06,18)
ESP_BOOT: length 22.1
  Top Layer w0.4: U7.27 37.73,25.91 v1(37.73,25.91) ; Q2.3 v1(38.64,36.97)
  Bottom Layer w0.4: v1(37.73,25.91) 37.73,36.05 v1(38.64,36.97)
ESP_RST: length 43.6
  Top Layer w0.4: v1(52.29,12.8) 52.29,5.92 53.75,4.46 U7.3 ; v1(35.55,33.75) 35.55,34.79 Q3.3
  Bottom Layer w0.4: v1(35.55,33.75) 35.77,33.54 35.77,22.4 38.23,19.94 45.15,19.94 v1(52.29,12.8)
M_EN_O: length 76.9
  Top Layer w0.4: U4.4 70.56,36.43 v1(71.52,37.38) ; P13.1 97.43,27.7 98.91,29.17 98.91,36.68 97.18,38.41 P10.1 ; P14.1 97.43,67.34 99.11,65.66 99.11,55.79 97.43,54.11 P6.1 97.18,51.16 98.96,49.38 98.96,42.43 97.43,40.91 P10.1 ; P10.1 P7.1
  Bottom Layer w0.4: P7.1 85.38,40.91 84.94,41.35 75.49,41.35 v1(71.52,37.38)
M_EN_O2: length 23.2
  Top Layer w0.4: H1.8 68.77,65.57 68.77,49.27 66.42,46.92 U12.4
MA_DIR: length 31.5
  Top Layer w0.4: v1(49.64,30.75) 44.57,25.69 U7.22 ; U9.2 59.67,40.99 59.64,40.95 59.64,39.37 v1(58.82,38.56)
  Bottom Layer w0.4: v1(49.64,30.75) 52.65,30.75 58.82,36.93 v1(58.82,38.56)
MA_STEP: length 20
  Top Layer w0.4: U7.16 52.19,20.86 62.08,30.75 66.98,30.75 U6.3
MB_DIR: length 33.1
  Top Layer w0.4: v1(53.77,39.27) 53.84,39.34 R34.1 53.87,40.99 U10.2 ; 43.3,27.02 v1(48.72,32.44) ; 43.3,27.02 U7.23 ; 43.3,27.02 43.29,27.03 40.61,27.03 39.59,26.01 R44.1
  Bottom Layer w0.4: v1(48.72,32.44) 53.77,37.49 v1(53.77,39.27)
MB_STEP: length 22
  Top Layer w0.4: U7.17 50.92,21.07 61.88,32.03 U6.2
MOTOR_EN: length 35.9
  Top Layer w0.4: v1(60.76,37.28) 60.86,37.38 U4.2 65.04,37.38 65.65,38 65.65,40.39 65.43,40.62 R36.1 65.47,40.99 U12.2 ; v1(50.46,29.79) 45.84,25.17 U7.21
  Bottom Layer w0.4: v1(60.76,37.28) 60.15,37.28 52.65,29.79 v1(50.46,29.79)
MX_DIR: length 20.1
  Top Layer w0.4: U7.7 57.14,9.54 58.46,10.86 58.46,12.44 61.83,15.81 61.83,18.11 63.63,19.91 R27.1 66.73,21.03 U5.2
MX_STEP: length 22.5
  Top Layer w0.4: U6.7 64,25.68 61.01,22.7 61.01,15.86 57.8,12.65 57.8,11.73 56.88,10.81 U7.8
MY_DIR: length 20.6
  Top Layer w0.4: U7.12 57.52,15.89 58.82,17.19 58.82,23.51 63.53,28.22 U6.5
MY_STEP: length 22.3
  Top Layer w0.4: U7.9 56.36,12.08 60.1,15.81 60.1,23.26 63.79,26.95 U6.6
MZ_DIR: length 38.6
  Top Layer w0.4: v1(69.33,39.22) 71.06,40.95 R35.1 71.27,40.99 U11.2 ; U7.20 47.11,25.47 48.06,26.42 53.21,26.42 v1(53.92,27.13)
  Bottom Layer w0.4: v1(69.33,39.22) 62.7,32.59 v1(59.33,32.59) 53.92,27.18 v1(53.92,27.13)
MZ_STEP: length 18.4
  Top Layer w0.4: U6.4 61.89,29.49 53.46,21.06 U7.15
PROBE: length 69.8
  Top Layer w0.4: v1(40.81,21.97) 40.76,21.93 U7.25 ; v1(68.41,71.96) 68.42,71.96 R22.1
  Bottom Layer w0.4: v1(68.41,71.96) 63.56,67.12 63.56,38.71 46.83,21.97 v1(40.81,21.97)
PWM: length 72.6
  Top Layer w0.4: v1(32.15,68.09) 32.2,68.14 U8.2 ; v1(34.7,21.42) 34.7,14.84 36.19,13.35 U7.31 ; v1(24.62,65.89) 24.36,66.15 R39.1 24.14,67.8 U13.2
  Bottom Layer w0.4: v1(34.7,21.42) 34.7,36.01 31.84,38.86 31.84,58.67 v1(24.62,65.89) 29.95,65.89 v1(32.15,68.09)
PWM_5V: length 4.1
  Top Layer w0.4: R45.2 28.32,73.92 R40.1 26.44,73.64 U13.4
PWM_LAS: length 11.4
  Top Layer w0.4: U8.4 33.15,74.43 31.72,75.86 P15.2
PWM_OUT: length 11
  Top Layer w0.4: 21.08,75.16 21.17,75.25 Q1.3 ; 21.08,75.16 P16.2 ; 21.08,75.16 R37.1
REST: length 46.5
  Top Layer w0.4: R21.1 18.92,48.4 21.47,45.85 v1(22,45.85) ; v1(33.78,19.89) 33.78,13.97 35.68,12.08 U7.32
  Bottom Layer w0.4: v1(22,45.85) 23.48,45.85 33.78,35.55 v1(33.78,19.89)
RXD0: length 41.8
  Top Layer w0.4: v1(21.05,28.56) 22.29,29.81 D12.2 ; R51.1 19.19,17.09 v1(19.09,16.98) ; v1(30.87,10.41) 30.87,10.3 33.32,7.85 34.31,7.85 R31.2 35.16,7 U7.36
  Bottom Layer w0.4: v1(30.87,10.41) 28.63,12.65 20.72,12.65 18.38,15 18.38,16.27 v1(19.09,16.98) 19.09,26.6 v1(21.05,28.56)
RXD1: length 48
  Top Layer w0.4: v1(40.66,14.67) 55.18,14.67 U7.11 57.53,14.62 v1(58.21,15.3) ; v1(61.63,10.97) R33.1 ; v1(19.45,15.25) 20.64,15.25 R53.1
  Bottom Layer w0.4: v1(40.66,14.67) 20.03,14.67 v1(19.45,15.25) ; v1(58.21,15.3) 61.63,11.88 v1(61.63,10.97)
TXD0: length 35.5
  Top Layer w0.4: D14.1 20.09,27.88 v1(20.98,27) ; U7.37 34.22,5.73 29.8,10.15 29.8,15.66 28.63,16.83 R50.1 26.62,19.81 v1(26.33,20.09)
  Bottom Layer w0.4: v1(26.33,20.09) 26.33,21.64 v1(20.98,27)
TXD1: length 29.3
  Top Layer w0.4: v1(41.07,13.92) 53.5,13.92 54.08,13.35 U7.10 ; R48.2 27.25,14.89 v1(28.27,13.87)
  Bottom Layer w0.4: v1(41.07,13.92) 28.32,13.92 v1(28.27,13.87)
U_D+: length 42.6
  Top Layer w0.4: 15.96,20.88 28.61,20.88 v1(31.61,17.88) ; v1(41.17,17.54) 42.06,18.43 U7.14
  Bottom Layer w0.4: v1(41.17,17.54) 41.18,17.54 41.18,17.47 39.42,15.71 33.78,15.71 v1(31.61,17.88)
U_D-: length 42
  Top Layer w0.4: U7.13 41.91,17.16 41.48,16.73 v1(39.34,16.73) ; U14.6 27.98,22.78 v1(31.89,18.87)
  Bottom Layer w0.4: v1(31.89,18.87) 34.03,16.73 v1(39.34,16.73)
USB_D+: length 3.4
  Top Layer w0.4: USB1.3 10.33,20.88 13.66,20.88
USB_D-: length 3.4
  Top Layer w0.4: USB1.2 10.37,22.78 U14.1
USB_DM: length 7.1
  Top Layer w0.4: P17.2 16.45,39.8 17.84,38.41 U16.3
USB_DP: length 9.3
  Top Layer w0.4: P17.3 11.25,41 16.92,41 17.6,40.31 U16.1
VUSB: length 14.4
  Top Layer w0.4: U16.5 20.3,39.36 19.85,38.9 19.85,35.96 18.01,34.12
  Top Layer w0.6: P17.1 14.63,37.3 17.81,34.12 D13.2
X_DIR_O: length 34.3
  Top Layer w0.4: v1(75.7,20.5) 75.28,20.08 U5.4 ; v1(94.88,25.72) 93.33,24.17 v1(90.8,24.17)
  Bottom Layer w0.4: v1(75.7,20.5) 79.37,24.17 v1(90.8,24.17) ; v1(94.88,25.72) 94.88,30.72 96.93,32.78 P13.3
X_LIMT: length 32
  Top Layer w0.4: R2.2 78.96,20.8 73.71,15.56 62.85,15.56 59.08,11.78 59.08,10.05 57.3,8.27 U7.6
X_LIMT_I: length 10
  Top Layer w0.4: R2.1 R1.1 83.28,19.58 D1.2
  Top Layer w0.6: D1.2 86.45,19.58 86.55,19.69 P1.1
X_STEP_O: length 26.6
  Top Layer w0.4: U6.10 76.65,25.68 81.2,30.24 P13.2
Y_DIR_O: length 35.2
  Top Layer w0.4: v1(80.04,34.22) 83.66,37.84 v1(83.66,42.38) ; P7.3 P10.3 ; U6.12 74.04,28.22 v1(77.49,31.67)
  Bottom Layer w0.4: v1(77.49,31.67) v1(80.04,34.22) ; P7.3 86.53,45.99 83.66,43.11 v1(83.66,42.38)
Y_LIMT: length 30.8
  Top Layer w0.4: R4.2 78.47,13.82 77.55,14.74 62.9,14.74 59.64,11.48 59.64,8.98 57.66,7 U7.5
Y_LIMT_I: length 10.2
  Top Layer w0.4: R4.1 R3.1
  Top Layer w0.6: P2.1 89.72,13.06 88.89,12.23 R3.1
Y_STEP_O: length 36.8
  Top Layer w0.4: 97.18,43.45 82.51,43.45 78.81,39.74 78.81,30.87 74.88,26.94 72.47,26.94 U6.11
Z_DIR_O: length 30.4
  Top Layer w0.4: v1(80.81,46.02) 93.98,59.19 P6.3 ; U11.4 v1(78.15,45.98)
  Bottom Layer w0.4: v1(78.15,45.98) 78.2,46.02 v1(80.81,46.02)
Z_LIMT: length 31.7
  Top Layer w0.4: R7.2 80.01,7.7 75.6,12.1 61.64,12.1 60.2,10.66 60.2,8.26 57.66,5.73 U7.4
Z_LIMT_I: length 10
  Top Layer w0.6: P4.1 85.71,6.43 85.45,6.17 81.98,6.17 81.93,6.11 R7.1
Z_STEP_O: length 40.9
  Top Layer w0.4: P6.2 92.73,56.65 77.89,41.82 77.89,33.36 74.03,29.49 U6.13
$9N72390: length 12.6
  Top Layer w0.8: D6.2 44.71,62.3 L1.2
  Top Layer w1: U1.2 52.34,59.38 L1.2
$9N72392: length 3.8
  Top Layer w0.4: U1.4 54.52,55.33 55.19,54.66 R11.1
$9N72730: length 1.8
  Top Layer w0.4: R9.1 21.12,64.15 D7.1
$9N85928: length 3.6
  Top Layer w0.4: U15.4 23.19,41.49 C24.1
$9N85949: length 4
  Top Layer w0.4: U16.6 21.44,40.22 U15.5
$9N85958: length 4.2
  Top Layer w0.4: U16.4 22.01,38.41 22.54,38.95 U15.6
$9N85962: length 10.9
  Top Layer w0.4: 30.04,32.94 30.04,34.47 26.83,37.68 U15.7 ; C25.1 30.36,32.85 Y1.2
$9N85965: length 7
  Top Layer w0.4: 25.35,36.41 25.35,33.43 Y1.1 24.78,32.87 C26.1
$9N86544: length 13.5
  Top Layer w0.4: D12.1 22.35,34.12 v1(23.57,35.33) ; U15.2 26.71,44.03 27.19,43.55 v1(27.19,38.95)
  Bottom Layer w0.4: v1(27.19,38.95) v1(23.57,35.33)
$9N86546: length 19.1
  Top Layer w0.4: U15.3 23.6,42.76 v1(23.57,42.73) 23.57,46.45 24.91,47.79 R46.1 ; D14.2 20.19,34.12 22.75,36.68 v1(22.75,36.92)
  Bottom Layer w0.4: v1(22.75,36.92) 22.75,41.91 v1(23.57,42.73)
$9N86982: length 6.8
  Top Layer w0.4: U15.13 33.72,41.49 R52.1 35.1,40.72 Q2.2
$9N86987: length 10.1
  Top Layer w0.4: Q3.2 32.95,38.44 v1(32.95,39.87) ; 34.45,42.78 34.43,42.76 U15.14
  Bottom Layer w0.4: v1(32.95,39.87) v1(32.95,42.78)
$9N87254: length 9.6
  Top Layer w0.4: P18.3 24.55,2.88 D15.2 26.1,9.78 R49.1
$9N87257: length 7
  Top Layer w0.4: P18.2 21.99,9.72 22.05,9.78
$9N89334: length 1.9
  Top Layer w0.4: Q2.1 36.64,42.18 R47.2
$9N89338: length 3
  Top Layer w0.4: R52.2 36.35,37.26 Q3.1
$9N98710: length 30.1
  Top Layer w0.4: R21.2 17.31,48.46 R14.2 17.31,50.59 K1.3 ; K1.3 15.32,49.09 C12.2 ; K1.3 K1.4 13.4,60.91 7.77,60.91 4.04,57.18 P12.1
$9N100484: length 12.1
  Top Layer w0.4: R17.2 73.19,73.75 71.81,73.75 71.81,75.7 C13.2 71.62,76.68 71.67,76.73 P9.2
$9N100840: length 1.8
  Top Layer w0.4: R12.1 21.1,58.39 D11.1
$9N100955: length 1.8
  Top Layer w0.4: R10.1 21.1,61.14 D9.1
$9N125401: length 10.3
  Top Layer w0.4: v1(19.3,76.35) 18.84,75.89 R38.1 ; Q1.1 24.71,77.25 R40.2
  Bottom Layer w0.4: v1(25.57,76.4) 25.52,76.35 v1(19.3,76.35)
$9N127736: length 28.5
  Top Layer w0.4: R16.2 20.32,54.18 17.66,56.83 17.66,62.59 14.77,65.48 10.61,65.48 C11.2 4.12,65.39 3.97,65.55 P11.1
$9N129587: length 4.1
  Top Layer w0.4: R51.2 22.34,15.25 R53.2 22,14.91 D16.2
$9N129623: length 3.9
  Top Layer w0.4: D15.1 25.02,13.64 R48.1 R50.2
$9N133119: length 2.5
  Top Layer w0.6: H1.4 H1.3
$9N136866: length 3.7
  Top Layer w0.4: U7.26 39.49,23.22 R44.2
$9N136869: length 4.2
  Top Layer w0.4: R28.2 34.54,1.17 36.56,3.19 U7.39
$9N136877: length 8.9
  Top Layer w0.4: v1(35.46,3.52) 35.16,3.21 R30.2 ; v1(39.29,7.91) 38.93,8.27 U7.35
  Bottom Layer w0.4: v1(39.29,7.91) 39.29,7.34 v1(35.46,3.52)
$9N136879: length 9.3
  Top Layer w0.4: v1(32.1,5.1) 31.91,5.1 R32.2 ; U7.34 36.33,9.54 v1(36.28,9.49)
  Bottom Layer w0.4: v1(36.28,9.49) 36.28,9.28 v1(32.1,5.1)
$9N139956: length 3.7
  Top Layer w0.4: R41.2 49.65,22.37 U7.18
$9N139992: length 3.5
  Top Layer w0.4: R42.2 48.38,22.88 U7.19
$9N140574: length 3.6
  Top Layer w0.4: R43.2 42.03,23.28 U7.24

## Copper pours and planes (outline as drawn; the poured copper is in the pictures)
GND on Top Layer: -2.02,87.07 101.81,87.07 101.81,-1.21 -2.02,-1.21
GND on Bottom Layer: -1.16,86.92 100.95,86.92 100.95,-1.11 -1.16,-1.11

Small or netless copper shapes (teardrops, artwork), in the pictures only: 460 on Top Layer, 107 on Bottom Layer

## Text on the board
Top Silkscreen Layer: 5V | 12V_DIV | A_LIMIT | CLK_Y2 | DIR_Y2 | EN | GND | LIMIT | CLK_A | CLK_Y1 | CLK_X | DIR_Y1 | DIR_A | DIR_X | CLK_Z | DIR_Z | X_LIMIT | Y_LIMIT | Z_LIMIT | RX | TX | CHANGE | RST | PWM | 24V+ | Probe | B-MOTOR
